# EAGLE design Varmo - Rev A3 (EAGLE 7.7.0)

## Sheet 1 of 3
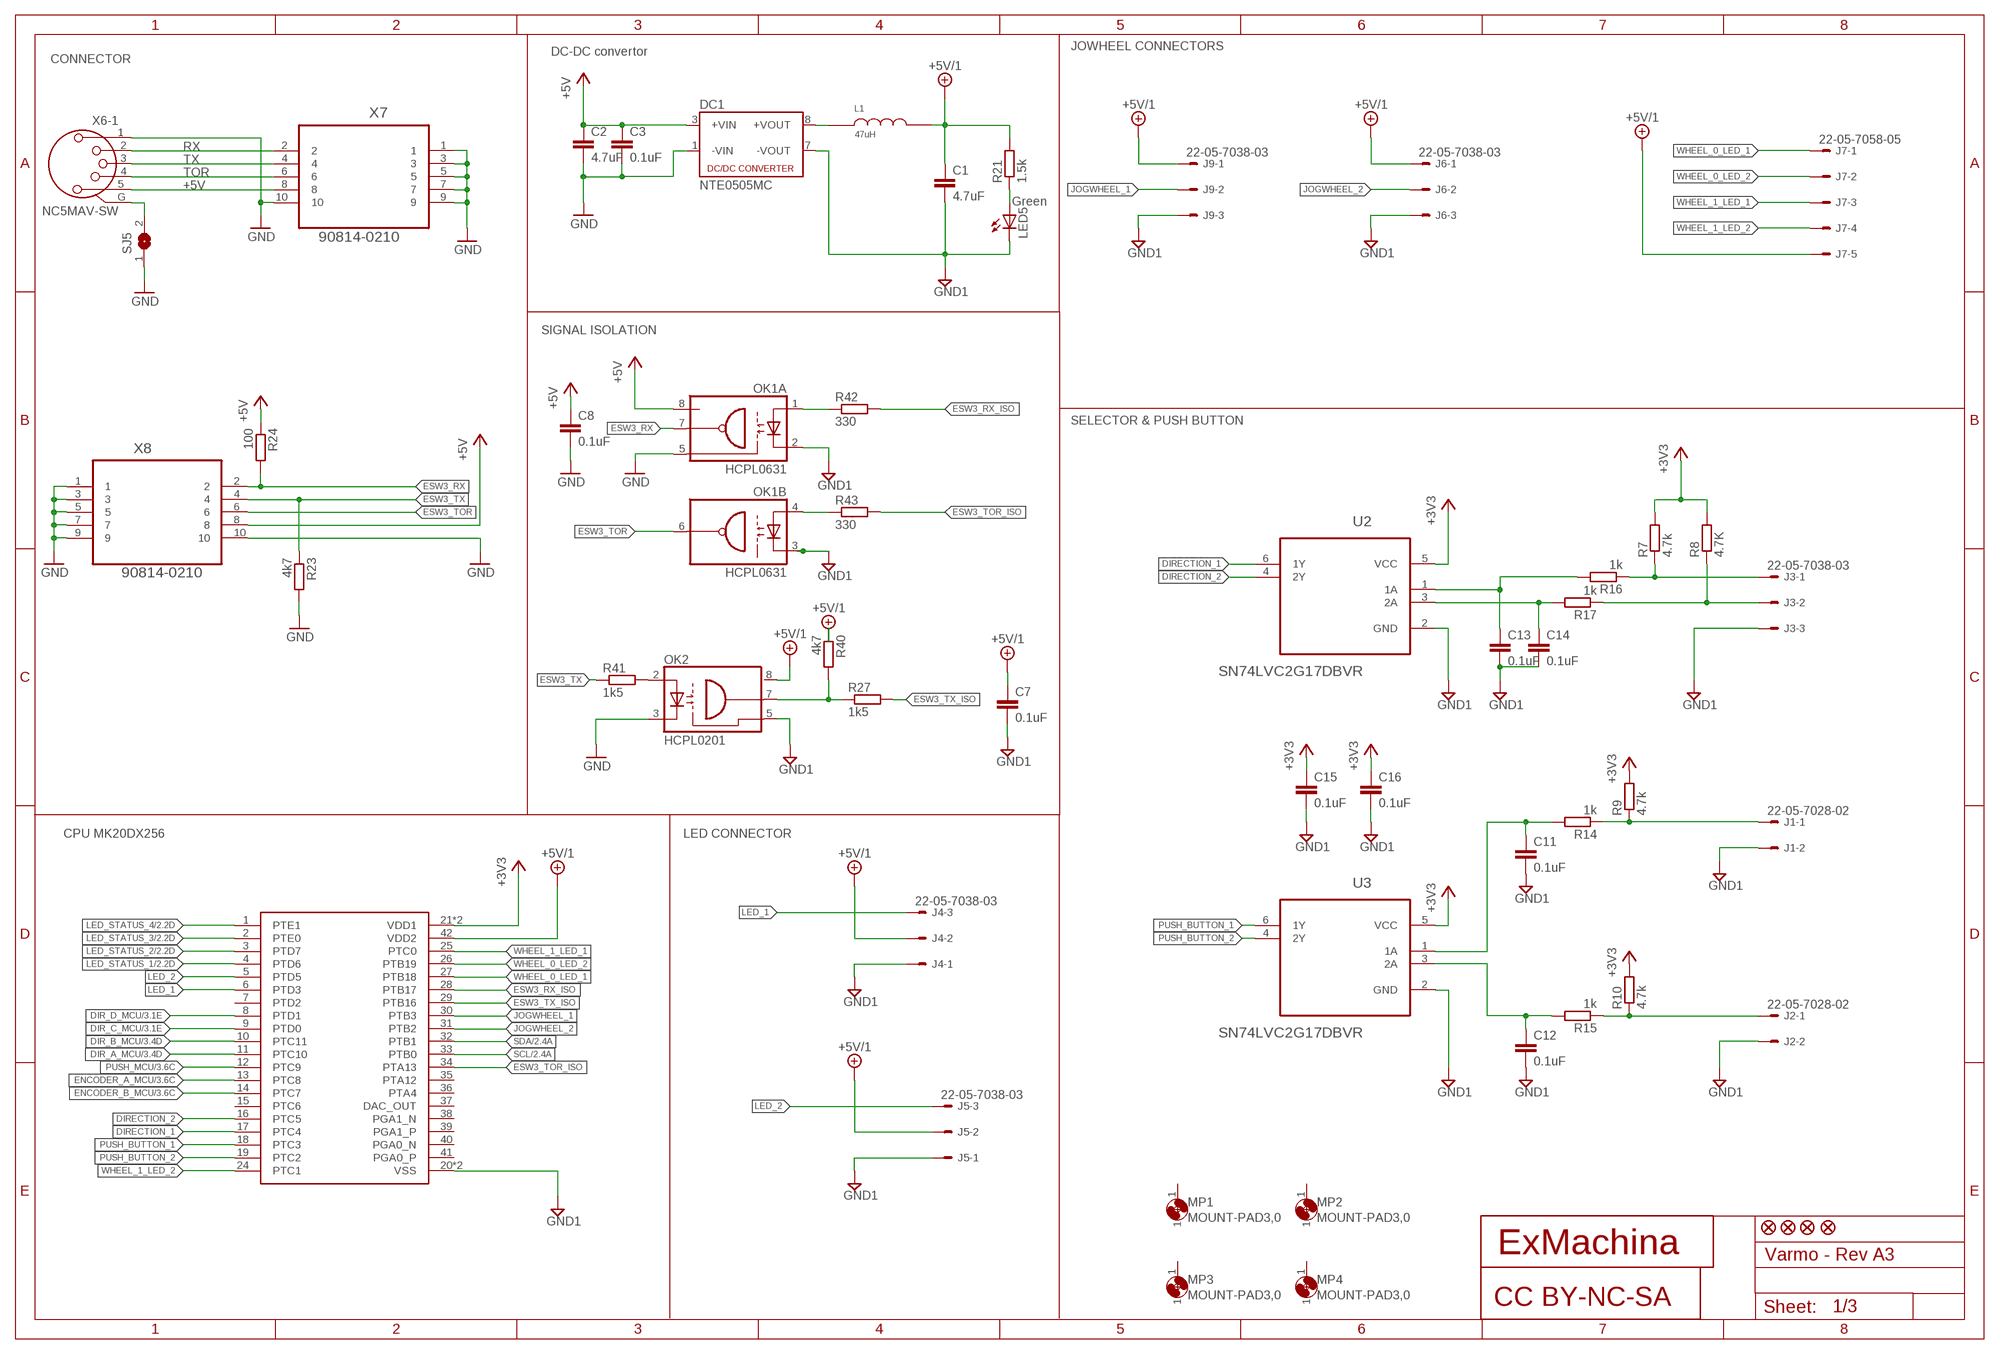
[diagram p0: schematic, sheet 1]

### Parts
C1  4.7uF  C-EUC0603  [C0603]
C2  4.7uF  C-EUC0603  [C0603]
C3  0.1uF  C-EUC0603  [C0603]
C7  0.1uF  C-EUC0603  [C0603]
C8  0.1uF  C-EUC0603  [C0603]
C11  0.1uF  C-EUC0603  [C0603]
C12  0.1uF  C-EUC0603  [C0603]
C13  0.1uF  C-EUC0603  [C0603]
C14  0.1uF  C-EUC0603  [C0603]
C15  0.1uF  C-EUC0603  [C0603]
C16  0.1uF  C-EUC0603  [C0603]
DC1  NTE0505MC  [NTE]
J1  22-05-7028-02  [7395-02]
J2  22-05-7028-02  [7395-02]
J3  22-05-7038-03  [7395-03]
J4  22-05-7038-03  [7395-03]
J5  22-05-7038-03  [7395-03]
J6  22-05-7038-03  [7395-03]
J7  22-05-7058-05  [7395-05]
J9  22-05-7038-03  [7395-03]
JP1  FIDUCIAL1X2  [FIDUCIAL-1X2]
JP2  FIDUCIAL1X2  [FIDUCIAL-1X2]
JP3  FIDUCIAL1X2  [FIDUCIAL-1X2]
JP4  FIDUCIAL1X2  [FIDUCIAL-1X2]
L1  47uH  82473C  [8200]
LED5  Green  LEDCHIP-LED0603  [CHIP-LED0603]
MP1  MOUNT-PAD3,0  [P3,0]
MP2  MOUNT-PAD3,0  [P3,0]
MP3  MOUNT-PAD3,0  [P3,0]
MP4  MOUNT-PAD3,0  [P3,0]
OK1  HCPL0631  [SOIC08]
OK2  HCPL0201  [SOIC08]
R7  4.7k  R-EU_R0603  [R0603]
R8  4.7K  R-EU_R0603  [R0603]
R9  4.7k  R-EU_R0603  [R0603]
R10  4.7k  R-EU_R0603  [R0603]
R14  1k  R-EU_R0603  [R0603]
R15  1k  R-EU_R0603  [R0603]
R16  1k  R-EU_R0603  [R0603]
R17  1k  R-EU_R0603  [R0603]
R21  1.5k  R-EU_R0603  [R0603]
R23  4k7  R-EU_R0603  [R0603]
R24  100  R-EU_R0603  [R0603]
R27  1k5  R-EU_R0603  [R0603]
R40  4k7  R-EU_R0603  [R0603]
R41  1k5  R-EU_R0603  [R0603]
R42  330  R-EU_R0603  [R0603]
R43  330  R-EU_R0603  [R0603]
SJ5  SJ  [SJ]
U2  SN74LVC2G17DBVR  [SOT95P280X145-6N]
U3  SN74LVC2G17DBVR  [SOT95P280X145-6N]
U8  M20DX256  [MK_CUSTOM]
U$1  CC-BY-NC-SA  [CC-BY-NC-SA]
U$6  EXMACHINA-LOGO-NAME  [EXM-LOGO-BASELINE]
X6  NC5MAV-SW  [NC5MAV-SW]
X7  90814-0210  [MOLEX_90814-0210]
X8  90814-0210  [MOLEX_90814-0210]

### Nets
+3V3: C15.1 C16.1 R7.2 R8.2 R9.2 R10.2 U2.5(VCC) U3.5(VCC) U8.21(VDD1) U8.22(VDD1) ; also sheet 2,3
+5V: C2.1 C3.1 C8.1 DC1.3(+VIN) OK1.8(A:VCC) R24.1 X6.5 X7.8 X8.8
+5V/1: C1.1 C7.1 J4.2 J5.2 J6.1 J7.5 J9.1 L1.2 OK2.8(VCC) R21.2 R40.1 U8.42(VDD2) ; also sheet 2,3
DIR_A_MCU: U8.11(PTC10) ; also sheet 3
DIR_B_MCU: U8.10(PTC11) ; also sheet 3
DIR_C_MCU: U8.9(PTD0) ; also sheet 3
DIR_D_MCU: U8.8(PTD1) ; also sheet 3
DIRECTION_1: U2.6(1Y) U8.17(PTC4)
DIRECTION_2: U2.4(2Y) U8.16(PTC5)
ENCODER_A_MCU: U8.13(PTC8) ; also sheet 3
ENCODER_B_MCU: U8.14(PTC7) ; also sheet 3
ESW3_RX: OK1.7(A:VO) R24.2 X8.2
ESW3_RX_ISO: R42.2 U8.28(PTB17)
ESW3_TOR: OK1.6(B:VO2) X8.6
ESW3_TOR_ISO: R43.2 U8.34(PTA13)
ESW3_TX: R23.1 R41.1 X8.4
ESW3_TX_ISO: R27.2 U8.29(PTB16)
GND: C2.2 C3.2 C8.2 DC1.1(-VIN) OK1.5(A:GND) OK2.3(C) R23.2 SJ5.1 X6.1 X7.1 X7.3 X7.5 X7.7 X7.9 X7.10 X8.1 X8.3 X8.5 X8.7 X8.9 X8.10
GND1: C1.2 C7.2 C11.2 C12.2 C13.2 C14.2 C15.2 C16.2 DC1.7(-VOUT) J1.2 J2.2 J3.3 J4.1 J5.1 J6.3 J9.3 LED5.C OK1.2(A:C1) OK1.3(B:C2) OK2.5(GND) U2.2(GND) U3.2(GND) U8.20(VSS) U8.23(VSS) ; also sheet 2,3
JOGWHEEL_1: J9.2 U8.30(PTB3)
JOGWHEEL_2: J6.2 U8.31(PTB2)
LED_1: J4.3 U8.6(PTD3)
LED_2: J5.3 U8.5(PTD5)
LED_STATUS_1: U8.4(PTD6) ; also sheet 2
LED_STATUS_2: U8.3(PTD7) ; also sheet 2
LED_STATUS_3: U8.2(PTE0) ; also sheet 2
LED_STATUS_4: U8.1(PTE1) ; also sheet 2
N$1: DC1.8(+VOUT) L1.1
N$6: J2.1 R10.1 R15.1
N$7: J1.1 R9.1 R14.1
N$8: J3.1 R7.1 R16.1
N$9: J3.2 R8.1 R17.1
N$10: C13.1 R16.2 U2.1(1A)
N$11: C14.1 R17.2 U2.3(2A)
N$12: C12.1 R15.2 U3.3(2A)
N$13: C11.1 R14.2 U3.1(1A)
N$15: OK2.7(VO) R27.1 R40.2
N$23: SJ5.2 X6.G(-1:G)
N$35: LED5.A R21.1
N$37: OK1.1(A:A1) R42.1
N$38: OK1.4(B:A2) R43.1
N$39: OK2.2(A) R41.2
PUSH_BUTTON_1: U3.6(1Y) U8.18(PTC3)
PUSH_BUTTON_2: U3.4(2Y) U8.19(PTC2)
PUSH_MCU: U8.12(PTC9) ; also sheet 3
RX: X6.2 X7.2
SCL: U8.33(PTB0) ; also sheet 2
SDA: U8.32(PTB1) ; also sheet 2
TOR: X6.4 X7.6
TX: X6.3 X7.4
WHEEL_0_LED_1: J7.1 U8.27(PTB18)
WHEEL_0_LED_2: J7.2 U8.26(PTB19)
WHEEL_1_LED_1: J7.3 U8.25(PTC0)
WHEEL_1_LED_2: J7.4 U8.24(PTC1)
Unconnected: MP1.1 MP2.1 MP3.1 MP4.1 U8.7(PTD2) U8.15(PTC6) U8.35(PTA12) U8.36(PTA4) U8.37(DAC_OUT) U8.38(PGA1_N) U8.39(PGA1_P) U8.40(PGA0_N) U8.41(PGA0_P) X6.N(-2:N) X6.NC(-2:NC) X6.NO(-2:NO)

### Notes on the sheet
- JOWHEEL CONNECTORS
- DC-DC convertor
- CONNECTOR
- SIGNAL ISOLATION
- SELECTOR & PUSH BUTTON
- CPU MK20DX256 | LED CONNECTOR

## Sheet 2 of 3: LCD Screen and LED panel
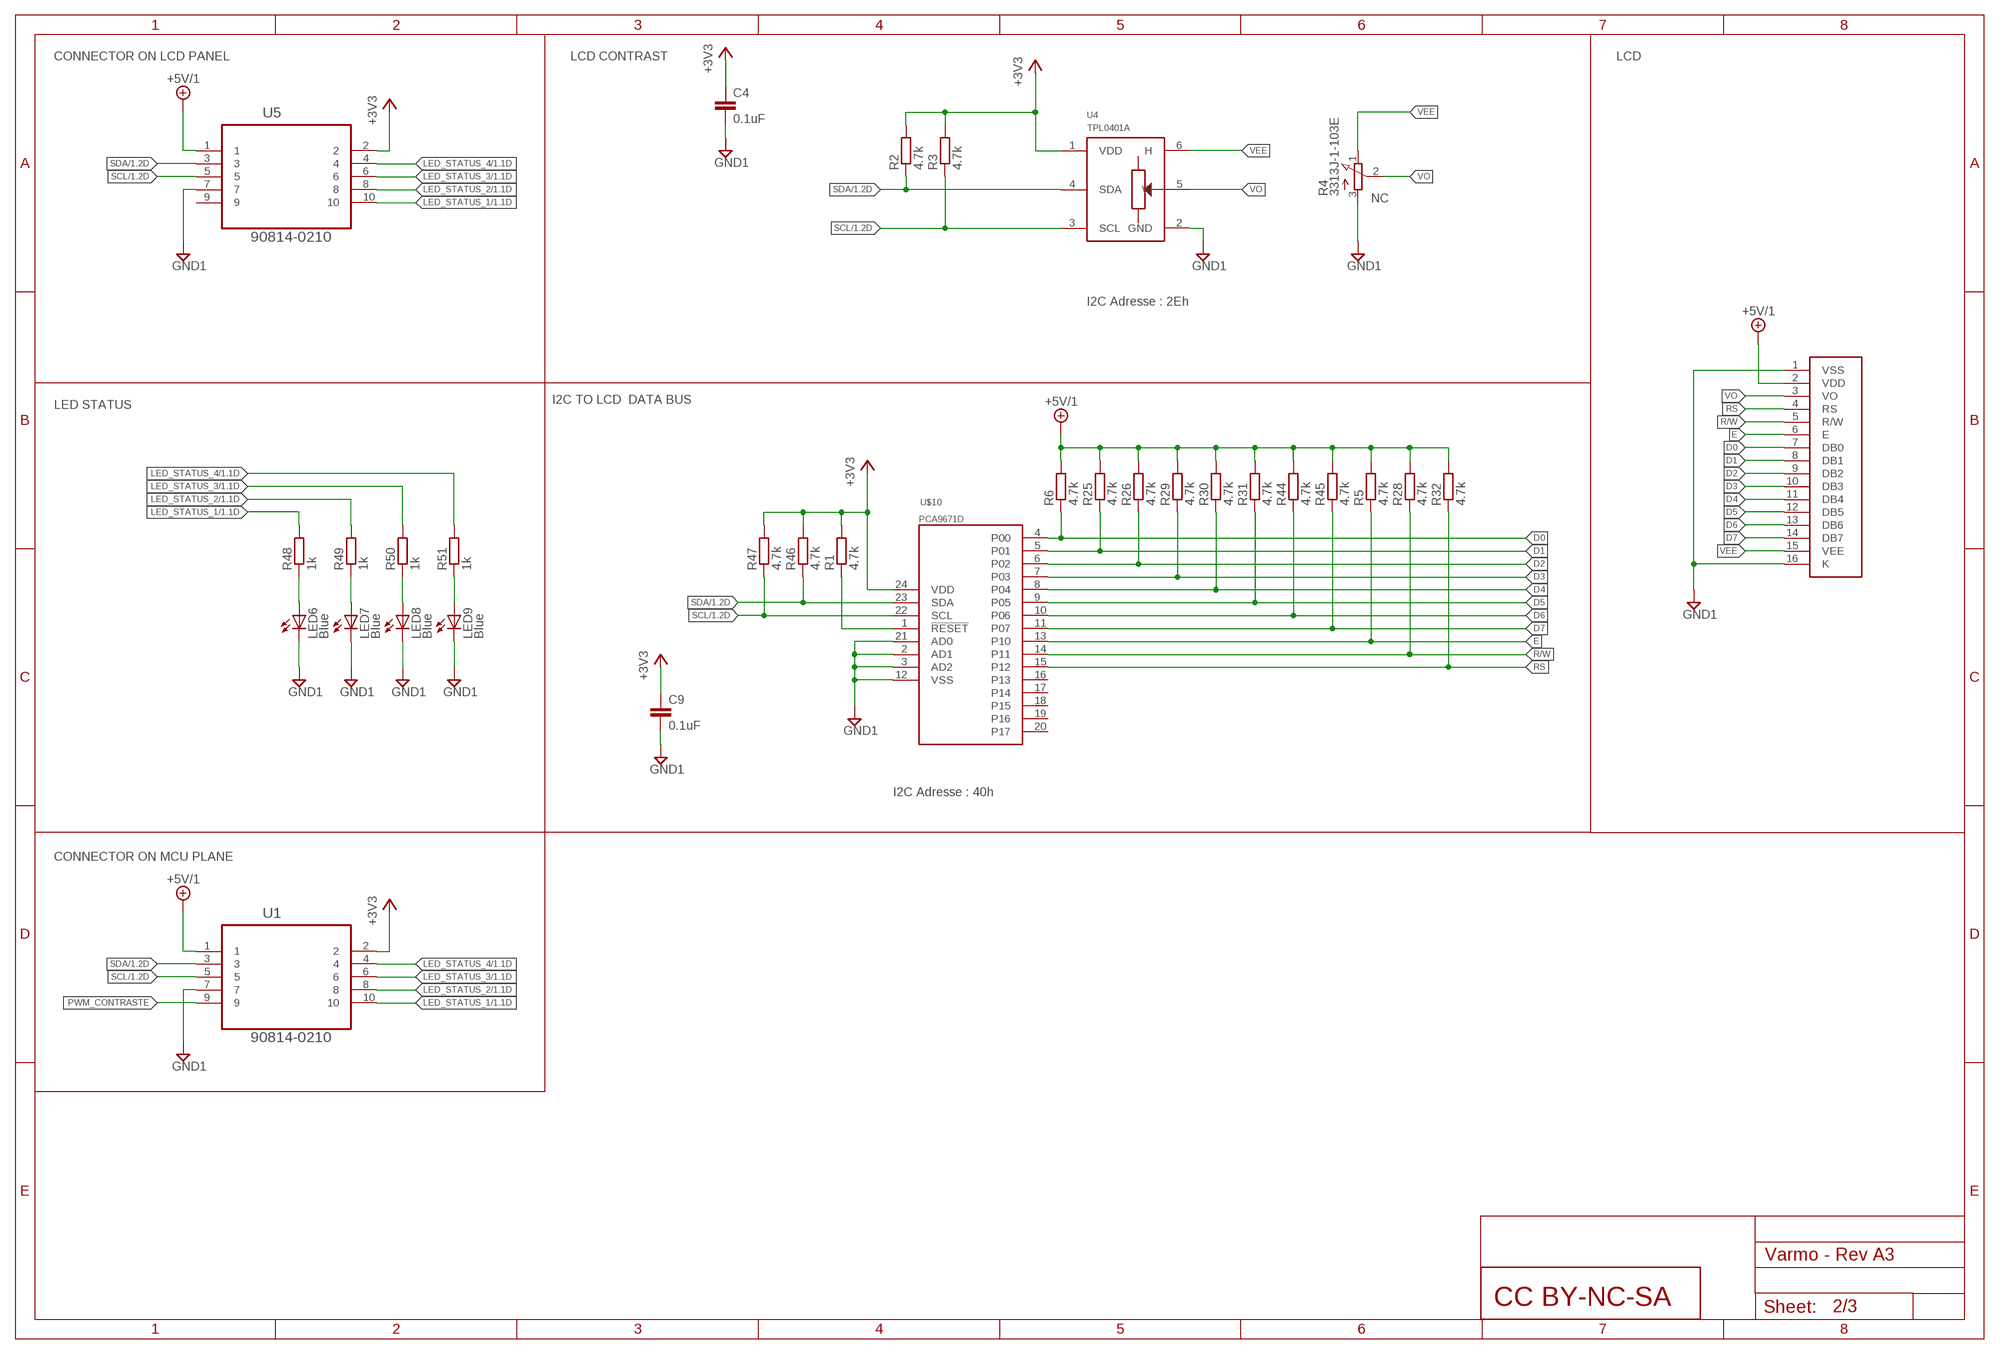
[diagram p1: schematic, sheet 2]

### Parts
C4  0.1uF  C-EUC0603  [C0603]
C9  0.1uF  C-EUC0603  [C0603]
LCD1  MC41605A12W  [CONNECTOR]
LED6  Blue  LEDCHIP-LED0603  [CHIP-LED0603]
LED7  Blue  LEDCHIP-LED0603  [CHIP-LED0603]
LED8  Blue  LEDCHIP-LED0603  [CHIP-LED0603]
LED9  Blue  LEDCHIP-LED0603  [CHIP-LED0603]
R1  4.7k  R-EU_R0603  [R0603]
R2  4.7k  R-EU_R0603  [R0603]
R3  4.7k  R-EU_R0603  [R0603]
R4  3313J-1-103E  [3313J]
R5  4.7k  R-EU_R0603  [R0603]
R6  4.7k  R-EU_R0603  [R0603]
R25  4.7k  R-EU_R0603  [R0603]
R26  4.7k  R-EU_R0603  [R0603]
R28  4.7k  R-EU_R0603  [R0603]
R29  4.7k  R-EU_R0603  [R0603]
R30  4.7k  R-EU_R0603  [R0603]
R31  4.7k  R-EU_R0603  [R0603]
R32  4.7k  R-EU_R0603  [R0603]
R44  4.7k  R-EU_R0603  [R0603]
R45  4.7k  R-EU_R0603  [R0603]
R46  4.7k  R-EU_R0603  [R0603]
R47  4.7k  R-EU_R0603  [R0603]
R48  1k  R-EU_R0603  [R0603]
R49  1k  R-EU_R0603  [R0603]
R50  1k  R-EU_R0603  [R0603]
R51  1k  R-EU_R0603  [R0603]
U1  90814-0210  [MOLEX_90814-0210]
U4  TPL0401A  [SC-70-DCK]
U5  90814-0210  [MOLEX_90814-0210]
U$5  CC-BY-NC-SA  [CC-BY-NC-SA]
U$10  PCA9671D  [SOT137-1]

### Nets
+3V3: C4.1 C9.1 R1.2 R2.2 R3.2 R46.2 R47.2 U1.2 U4.1(VDD) U5.2 U$10.24(VDD) ; also sheet 1,3
+5V/1: LCD1.2(VDD) R5.2 R6.2 R25.2 R26.2 R28.2 R29.2 R30.2 R31.2 R32.2 R44.2 R45.2 U1.1 U5.1 ; also sheet 1,3
D0: LCD1.7(DB0) R6.1 U$10.4(P00)
D1: LCD1.8(DB1) R25.1 U$10.5(P01)
D2: LCD1.9(DB2) R26.1 U$10.6(P02)
D3: LCD1.10(DB3) R29.1 U$10.7(P03)
D4: LCD1.11(DB4) R30.1 U$10.8(P04)
D5: LCD1.12(DB5) R31.1 U$10.9(P05)
D6: LCD1.13(DB6) R44.1 U$10.10(P06)
D7: LCD1.14(DB7) R45.1 U$10.11(P07)
E: LCD1.6(E) R5.1 U$10.13(P10)
GND1: C4.2 C9.2 LCD1.1(VSS) LCD1.16(K) LED6.C LED7.C LED8.C LED9.C R4.3(A) U1.7 U4.2(GND) U5.7 U$10.2(AD1) U$10.3(AD2) U$10.12(VSS) U$10.21(AD0) ; also sheet 1,3
LED_STATUS_1: R48.2 U1.10 U5.10 ; also sheet 1
LED_STATUS_2: R49.2 U1.8 U5.8 ; also sheet 1
LED_STATUS_3: R50.2 U1.6 U5.6 ; also sheet 1
LED_STATUS_4: R51.2 U1.4 U5.4 ; also sheet 1
N$2: R1.1 U$10.1(!RESET)
N$4: LED6.A R48.1
N$22: LED7.A R49.1
N$24: LED8.A R50.1
N$29: LED9.A R51.1
PWM_CONTRASTE: U1.9
R/W: LCD1.5(R/W) R28.1 U$10.14(P11)
RS: LCD1.4(RS) R32.1 U$10.15(P12)
SCL: R3.1 R47.1 U1.5 U4.3(SCL) U5.5 U$10.22(SCL) ; also sheet 1
SDA: R2.1 R46.1 U1.3 U4.4(SDA) U5.3 U$10.23(SDA) ; also sheet 1
VEE: LCD1.15(VEE) R4.1(E) U4.6(H)
VO: LCD1.3(VO) R4.2(S) U4.5(W)
Unconnected: U5.9 U$10.16(P13) U$10.17(P14) U$10.18(P15) U$10.19(P16) U$10.20(P17)

### Notes on the sheet
- CONNECTOR ON LCD PANEL | LCD CONTRAST | LCD
- NC
- I2C Adresse : 2Eh
- I2C TO LCD  DATA BUS
- LED STATUS
- I2C Adresse : 40h
- CONNECTOR ON MCU PLANE

## Sheet 3 of 3: ENCODER AND JOYSTICK
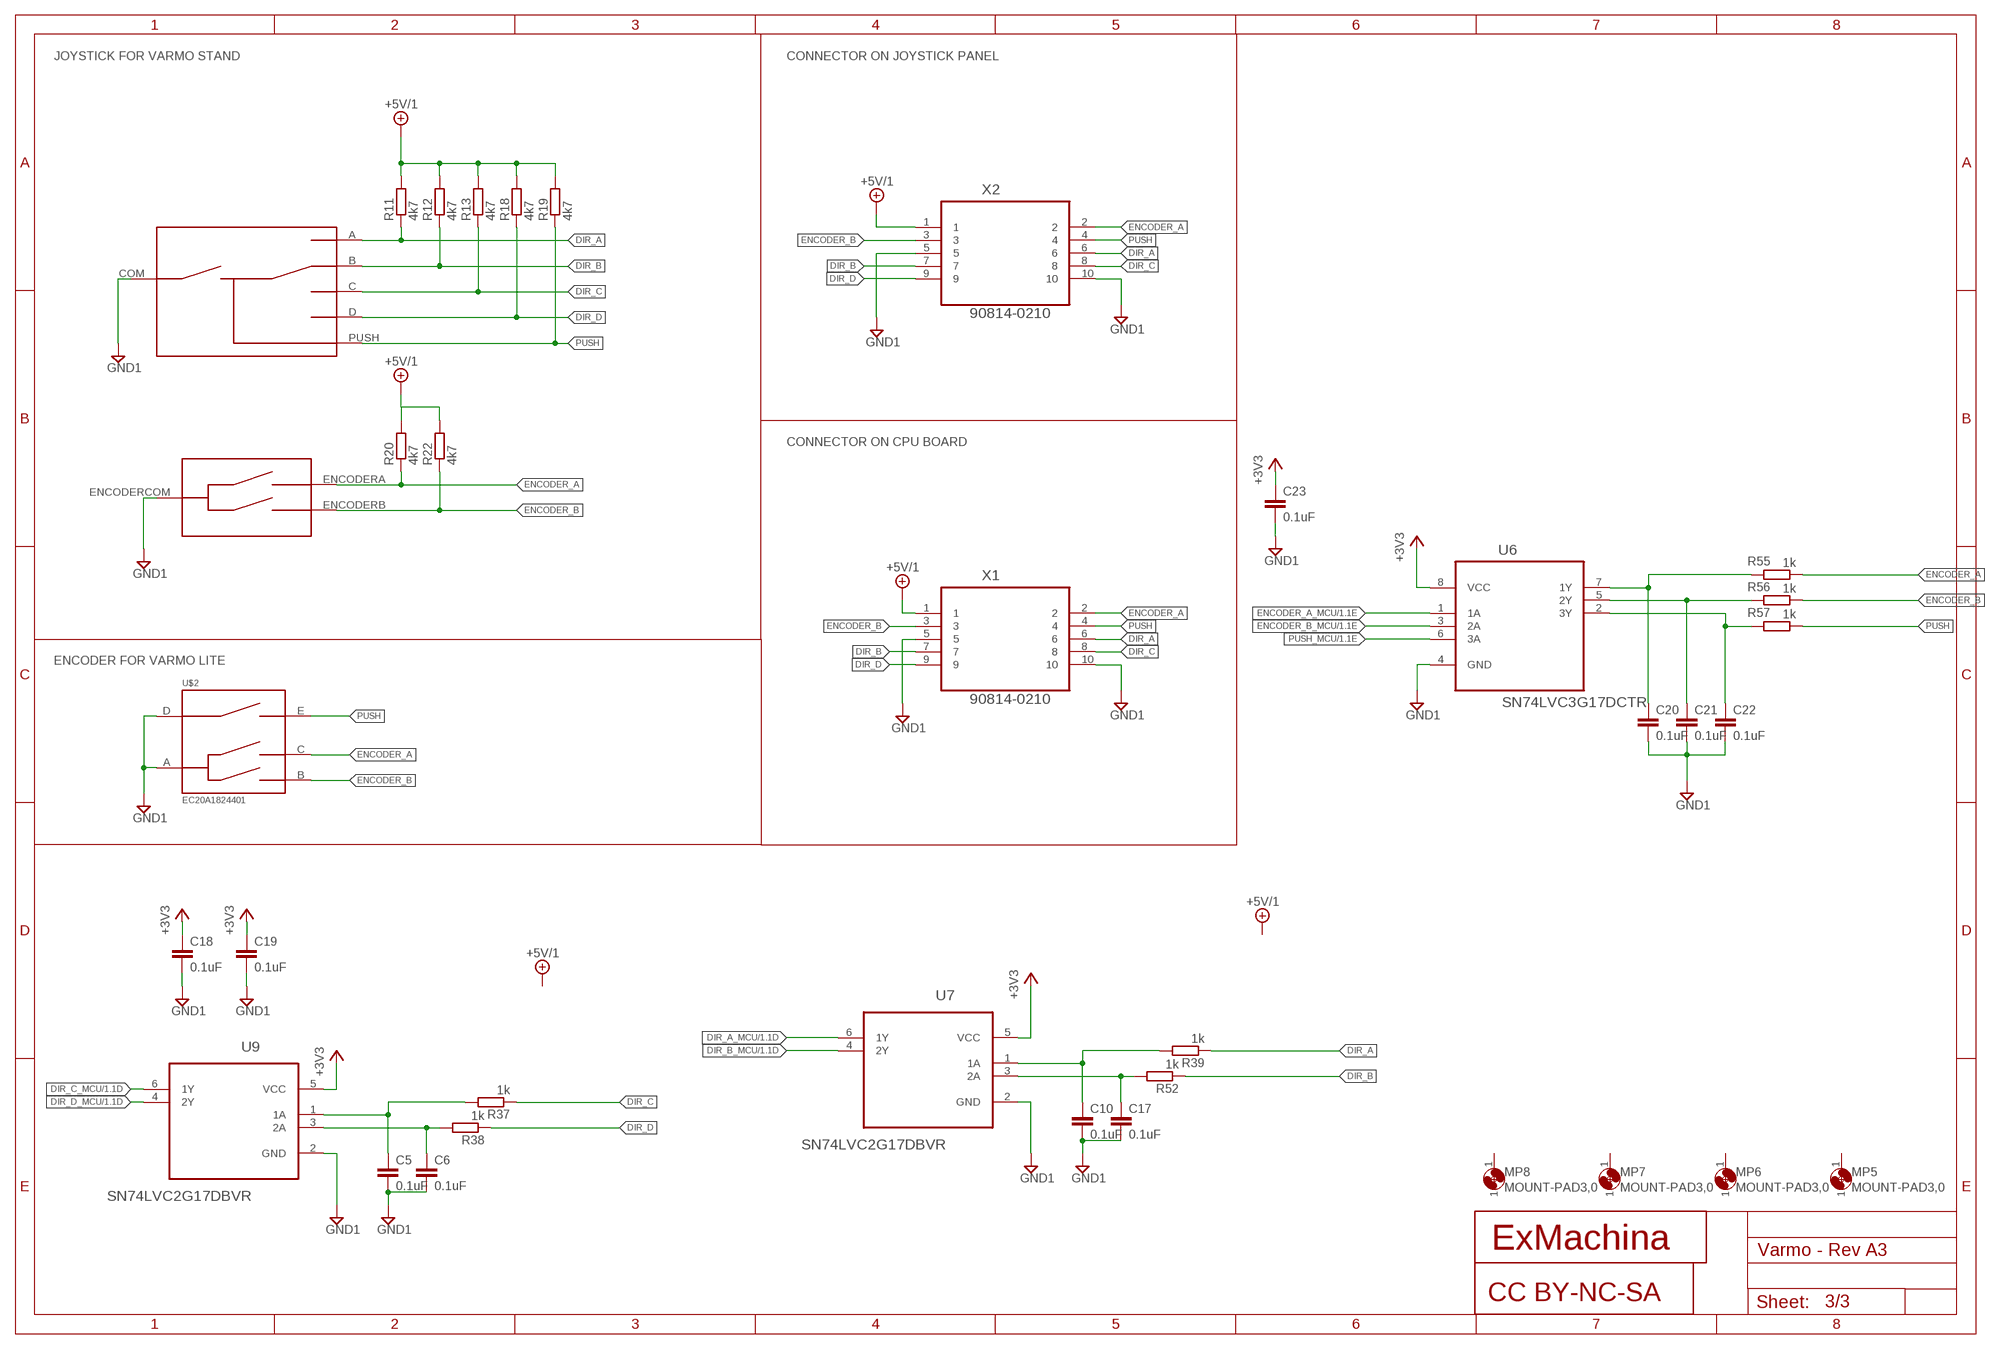
[diagram p2: schematic, sheet 3]

### Parts
C5  0.1uF  C-EUC0603  [C0603]
C6  0.1uF  C-EUC0603  [C0603]
C10  0.1uF  C-EUC0603  [C0603]
C17  0.1uF  C-EUC0603  [C0603]
C18  0.1uF  C-EUC0603  [C0603]
C19  0.1uF  C-EUC0603  [C0603]
C20  0.1uF  C-EUC0603  [C0603]
C21  0.1uF  C-EUC0603  [C0603]
C22  0.1uF  C-EUC0603  [C0603]
C23  0.1uF  C-EUC0603  [C0603]
ENC1  RKJXTF42001  [RKJXT1F]
MP5  MOUNT-PAD3,0  [P3,0]
MP6  MOUNT-PAD3,0  [P3,0]
MP7  MOUNT-PAD3,0  [P3,0]
MP8  MOUNT-PAD3,0  [P3,0]
R11  4k7  R-EU_R0603  [R0603]
R12  4k7  R-EU_R0603  [R0603]
R13  4k7  R-EU_R0603  [R0603]
R18  4k7  R-EU_R0603  [R0603]
R19  4k7  R-EU_R0603  [R0603]
R20  4k7  R-EU_R0603  [R0603]
R22  4k7  R-EU_R0603  [R0603]
R37  1k  R-EU_R0603  [R0603]
R38  1k  R-EU_R0603  [R0603]
R39  1k  R-EU_R0603  [R0603]
R52  1k  R-EU_R0603  [R0603]
R55  1k  R-EU_R0603  [R0603]
R56  1k  R-EU_R0603  [R0603]
R57  1k  R-EU_R0603  [R0603]
U6  SN74LVC3G17DCTR  [SOP65P400X130-8N]
U7  SN74LVC2G17DBVR  [SOT95P280X145-6N]
U9  SN74LVC2G17DBVR  [SOT95P280X145-6N]
U$2  EC20A1824401  [EC20A]
U$3  EXMACHINA-LOGO-NAME  [EXM-LOGO-BASELINE]
U$4  CC-BY-NC-SA  [CC-BY-NC-SA]
X1  90814-0210  [MOLEX_90814-0210]
X2  90814-0210  [MOLEX_90814-0210]

### Nets
+3V3: C18.1 C19.1 C23.1 U6.8(VCC) U7.5(VCC) U9.5(VCC) ; also sheet 1,2
+5V/1: R11.2 R12.2 R13.2 R18.2 R19.2 R20.2 R22.2 X1.1 X2.1 ; also sheet 1,2
DIR_A: ENC1.A R11.1 R39.1 X1.6 X2.6
DIR_A_MCU: U7.6(1Y) ; also sheet 1
DIR_B: ENC1.B R12.1 R52.1 X1.7 X2.7
DIR_B_MCU: U7.4(2Y) ; also sheet 1
DIR_C: ENC1.C R13.1 R37.1 X1.8 X2.8
DIR_C_MCU: U9.6(1Y) ; also sheet 1
DIR_D: ENC1.D R18.1 R38.1 X1.9 X2.9
DIR_D_MCU: U9.4(2Y) ; also sheet 1
ENCODER_A: ENC1.ENCODERA(A) R20.1 R55.1 U$2.C(ENCODER_A) X1.2 X2.2
ENCODER_A_MCU: U6.1(1A) ; also sheet 1
ENCODER_B: ENC1.ENCODERB(B) R22.1 R56.1 U$2.B(ENCODER_B) X1.3 X2.3
ENCODER_B_MCU: U6.3(2A) ; also sheet 1
GND1: C5.2 C6.2 C10.2 C17.2 C18.2 C19.2 C20.2 C21.2 C22.2 C23.2 ENC1.COM ENC1.ENCODERCOM(COM) U6.4(GND) U7.2(GND) U9.2(GND) U$2.A(COM) U$2.D(COM_PUSH) X1.5 X1.10 X2.5 X2.10 ; also sheet 1,2
N$17: C10.1 R39.2 U7.1(1A)
N$30: C17.1 R52.2 U7.3(2A)
N$31: C5.1 R37.2 U9.1(1A)
N$32: C6.1 R38.2 U9.3(2A)
N$40: C20.1 R55.2 U6.7(1Y)
N$41: C21.1 R56.2 U6.5(2Y)
N$42: C22.1 R57.2 U6.2(3Y)
PUSH: ENC1.PUSH R19.1 R57.1 U$2.E(PUSH) X1.4 X2.4
PUSH_MCU: U6.6(3A) ; also sheet 1
Unconnected: MP5.1 MP6.1 MP7.1 MP8.1

### Notes on the sheet
- JOYSTICK FOR VARMO STAND | CONNECTOR ON JOYSTICK PANEL
- CONNECTOR ON CPU BOARD
- ENCODER FOR VARMO LITE

## Library data of the parts
C1 C2 = rcl:C-EU: CAPACITOR, European symbol; MPN: MC0603X475K100CT; OC_NEWARK: 06X6198
C3 C5-C8 C10-C23 = rcl:C-EU: CAPACITOR, European symbol; MPN: MC0603B104K160CT; OC_NEWARK: 06R4923
C4 C9 = rcl:C-EU: CAPACITOR, European symbol
DC1 = dc-dc-converter:NTE; MF: C & D TECHNOLOGIES, INC; MPN: NTE0505MC; OC_NEWARK: 61K3399
ENC1 = encoder:RKJXTF: 4-directional Stick Switch (with Encoder + Center-push Function)
J1 J2 = con-molex:22-?-02: CONNECTOR wire to board 2.54 mm (.1 inch) pitch header; OC_FARNELL: 9731601; OC_NEWARK: unknown
J3-J6 J9 = con-molex:22-?-03: CONNECTOR wire to board 2.54 mm (.1 inch) pitch header; OC_FARNELL: unknown; OC_NEWARK: unknown
J7 = con-molex:22-?-05: CONNECTOR wire to board 2.54 mm (.1 inch) pitch header; OC_FARNELL: unknown; OC_NEWARK: unknown
JP1-JP4 = SparkFun:FIDUCIAL: Fiducial Alignment Points Various fiducial points for machine vision alignment.
L1 = murata-inductance:82473C; MPN: 82473C; OC_NEWARK: 40M7122
LCD1 = midas:MC41605A12W
LED5 = led:LED: LED OSRAM: - CHIPLED LG R971, LG N971, LY N971, LG Q971, LY Q971, LO R971, LY R971 LH N974, LH R974 LS Q976, LO Q976, LY Q976 LO Q996 - Hyper CHIPLED LW Q18S LB Q993, LB Q99A, LB R99A - SideLED LS A670, LO A670, LY A670, LG A670, LP A670 LB A673, LV A673, LT A673, LW A673 LH A674 LY A675 LS A676, LA A676, LO A676, LY A676, LW A676 LS A679, LY A679, LG A679 - Hyper Micro SIDELED® LS Y876, LA Y876, LO Y876, LY Y876 LT Y87S - SmartLED LW L88C, LW L88S LB L89C, LB L89S, LG L890 LS L89K, LO L89K, LY L89K LS L896, LA L896, LO L896, LY L896 - TOPLED LS T670, LO T670, LY T670, LG T670, LP T670 LSG T670, LSP T670, LSY T670, LOP T670, LYG T670 LG T671, LOG T671, LSG T671 LB T673, LV T673, LT T673, LW T673 LH T674 LS T676, LA T676, LO T676, LY T676, LB T676, LH T676, LSB T676, LW T676 LB T67C, LV T67C, LT T67C, LS T67K, LO T67K, LY T67K, LW E67C LS E67B, LA E67B, LO E67B, LY E67B, LB E67C, LV E67C, LT E67C LW T67C LS T679, LY T679, LG T679 LS T770, LO T770, LY T770, LG T770, LP T770 LB T773, LV T773, LT T773, LW T773 LH T774 LS E675, LA E675, LY E675, LS T675 LS T776, LA T776, LO T776, LY T776, LB T776 LHGB T686 LT T68C, LB T68C - Hyper Mini TOPLED® LB M676 - Mini TOPLED Santana® LG M470 LS M47K, LO M47K, LY M47K Source: http://www.osram.convergy.de LUXEON: - LUMILED® LXK2-PW12-R00, LXK2-PW12-S00, LXK2-PW14-U00, LXK2-PW14-V00 LXK2-PM12-R00, LXK2-PM12-S00, LXK2-PM14-U00 LXK2-PE12-Q00, LXK2-PE12-R00, LXK2-PE12-S00, LXK2-PE14-T00, LXK2-PE14-U00 LXK2-PB12-K00, LXK2-PB12-L00, LXK2-PB12-M00, LXK2-PB14-N00, LXK2-PB14-P00, LXK2-PB14-Q00 LXK2-PR12-L00, LXK2-PR12-M00, LXK2-PR14-Q00, LXK2-PR14-R00 LXK2-PD12-Q00, LXK2-PD12-R00, LXK2-PD12-S00 LXK2-PH12-R00, LXK2-PH12-S00 LXK2-PL12-P00, LXK2-PL12-Q00, LXK2-PL12-R00 Source: www.luxeon.com KINGBRIGHT: KA-3528ASYC Source: www.kingbright.com; MPN: OVS-0604; OC_NEWARK: 15R2206
LED6-LED9 = led:LED: LED OSRAM: - CHIPLED LG R971, LG N971, LY N971, LG Q971, LY Q971, LO R971, LY R971 LH N974, LH R974 LS Q976, LO Q976, LY Q976 LO Q996 - Hyper CHIPLED LW Q18S LB Q993, LB Q99A, LB R99A - SideLED LS A670, LO A670, LY A670, LG A670, LP A670 LB A673, LV A673, LT A673, LW A673 LH A674 LY A675 LS A676, LA A676, LO A676, LY A676, LW A676 LS A679, LY A679, LG A679 - Hyper Micro SIDELED® LS Y876, LA Y876, LO Y876, LY Y876 LT Y87S - SmartLED LW L88C, LW L88S LB L89C, LB L89S, LG L890 LS L89K, LO L89K, LY L89K LS L896, LA L896, LO L896, LY L896 - TOPLED LS T670, LO T670, LY T670, LG T670, LP T670 LSG T670, LSP T670, LSY T670, LOP T670, LYG T670 LG T671, LOG T671, LSG T671 LB T673, LV T673, LT T673, LW T673 LH T674 LS T676, LA T676, LO T676, LY T676, LB T676, LH T676, LSB T676, LW T676 LB T67C, LV T67C, LT T67C, LS T67K, LO T67K, LY T67K, LW E67C LS E67B, LA E67B, LO E67B, LY E67B, LB E67C, LV E67C, LT E67C LW T67C LS T679, LY T679, LG T679 LS T770, LO T770, LY T770, LG T770, LP T770 LB T773, LV T773, LT T773, LW T773 LH T774 LS E675, LA E675, LY E675, LS T675 LS T776, LA T776, LO T776, LY T776, LB T776 LHGB T686 LT T68C, LB T68C - Hyper Mini TOPLED® LB M676 - Mini TOPLED Santana® LG M470 LS M47K, LO M47K, LY M47K Source: http://www.osram.convergy.de LUXEON: - LUMILED® LXK2-PW12-R00, LXK2-PW12-S00, LXK2-PW14-U00, LXK2-PW14-V00 LXK2-PM12-R00, LXK2-PM12-S00, LXK2-PM14-U00 LXK2-PE12-Q00, LXK2-PE12-R00, LXK2-PE12-S00, LXK2-PE14-T00, LXK2-PE14-U00 LXK2-PB12-K00, LXK2-PB12-L00, LXK2-PB12-M00, LXK2-PB14-N00, LXK2-PB14-P00, LXK2-PB14-Q00 LXK2-PR12-L00, LXK2-PR12-M00, LXK2-PR14-Q00, LXK2-PR14-R00 LXK2-PD12-Q00, LXK2-PD12-R00, LXK2-PD12-S00 LXK2-PH12-R00, LXK2-PH12-S00 LXK2-PL12-P00, LXK2-PL12-Q00, LXK2-PL12-R00 Source: www.luxeon.com KINGBRIGHT: KA-3528ASYC Source: www.kingbright.com
MP1-MP8 = holes:MOUNT-PAD: MOUNTING HOLE with drill center marker
OK1 = optocoupler:HCPL0631
OK2 = optocoupler:HCPL0201
R1-R3 R5 R6 R25 R26 R28-R32 R44-R51 = rcl:R-EU_: RESISTOR, European symbol
R4 = pot:3313J
R7-R10 R14-R17 R37-R39 R52 R55-R57 = rcl:R-EU_: RESISTOR, European symbol; MPN: MCMR06X4701FTL; OC_NEWARK: 86T3649
R11-R13 R18-R20 R22-R24 R27 R40-R43 = rcl:R-EU_: RESISTOR, European symbol; MPN: MCMR06X000 PTL; OC_NEWARK: 86T3500
R21 = rcl:R-EU_: RESISTOR, European symbol; MPN: MCMR06X1501FTL; OC_NEWARK: 86T3542
SJ5 = jumper:SJ: SMD solder JUMPER; OC_NEWARK: unknown
U1 U5 X1 X2 X7 X8 = Molex_By_element14_Batch_1:90814-0210: CONN HEADER 10POS 1.27MM SMD TIN; MPN: 90814-0210; OC_FARNELL: 1757026; OC_NEWARK: 34R6217; PACKAGE: CONN-10POS; SUPPLIER: Molex
U2 U3 U7 U9 = ti:SN74LVC2G17DBVR: DUAL SCHMITT-TRIGGER BUFFER; MF: TEXAS INSTRUMENTS; MPN: SN74LVC2G17DBVR; OC_FARNELL: 1470776; OC_NEWARK: 76C4207; PACKAGE: SOT-23-6; SUPPLIER: Texas Instruments
U4 = ti:TPL0401
U6 = ti:SN74LVC3G17DCTR: TRIPLE SCHMITT-TRIGGER BUFFER; MPN: SN74LVC3G17DCTR; OC_FARNELL: 1236391; OC_NEWARK: 90H3713; PACKAGE: SSOP-8; SUPPLIER: Texas Instruments
U8 = custom:M20DX256
U$1 U$4 U$5 = cc-by-sa:CC-BY-NC-SA
U$2 = encoder:EC20A
U$3 U$6 = exmachina:EXMACHINA-LOGO
U$10 = NXP:PCA9671D: Remote 16-bit I/O expander for Fm+ I2C-bus with reset
X6 = con-neutrik_ag:NC5?-SW: Neutrik Audio Connector XLR SERIES Stereo 1/4" jack Source: www.neutrik.com/; MPN: NC5MAV-SW; OC_FARNELL: unknown; OC_NEWARK: 31M5714

## Net classes
0 default: width 0.178 mm, drill 0.35 mm
1 power: width 0.406 mm, drill 0.013 mm

## Board
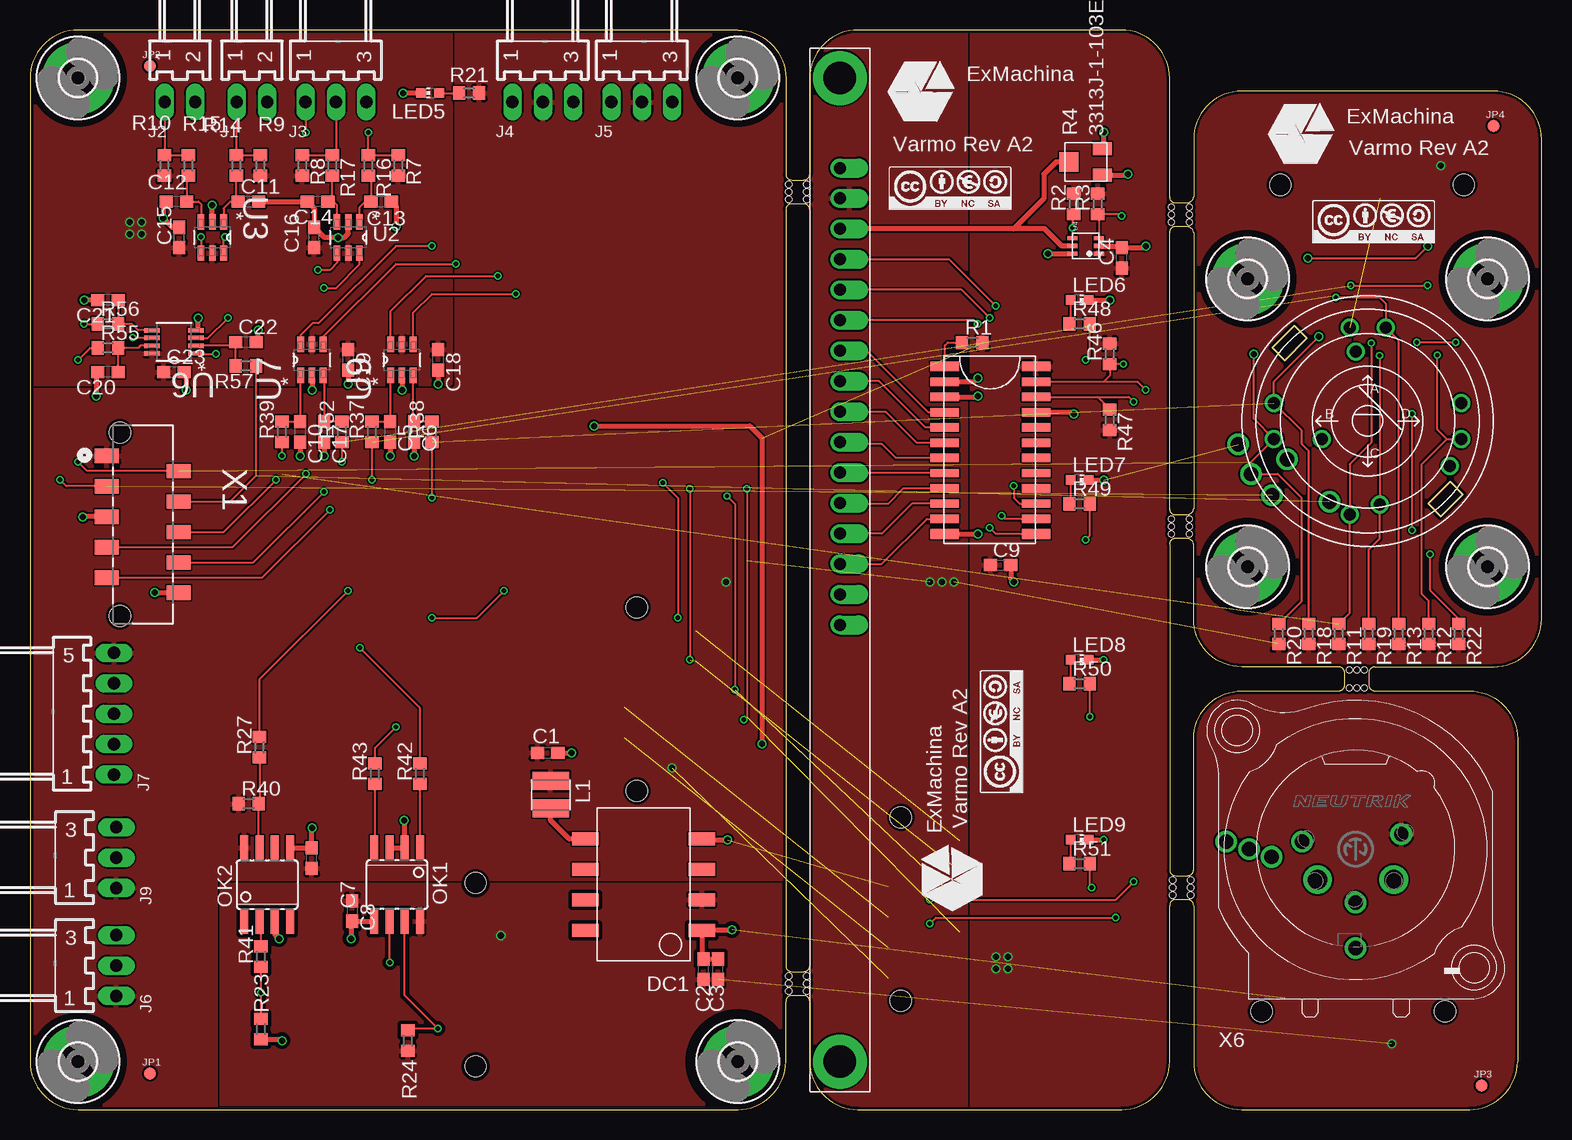
[diagram p3: board, top side]
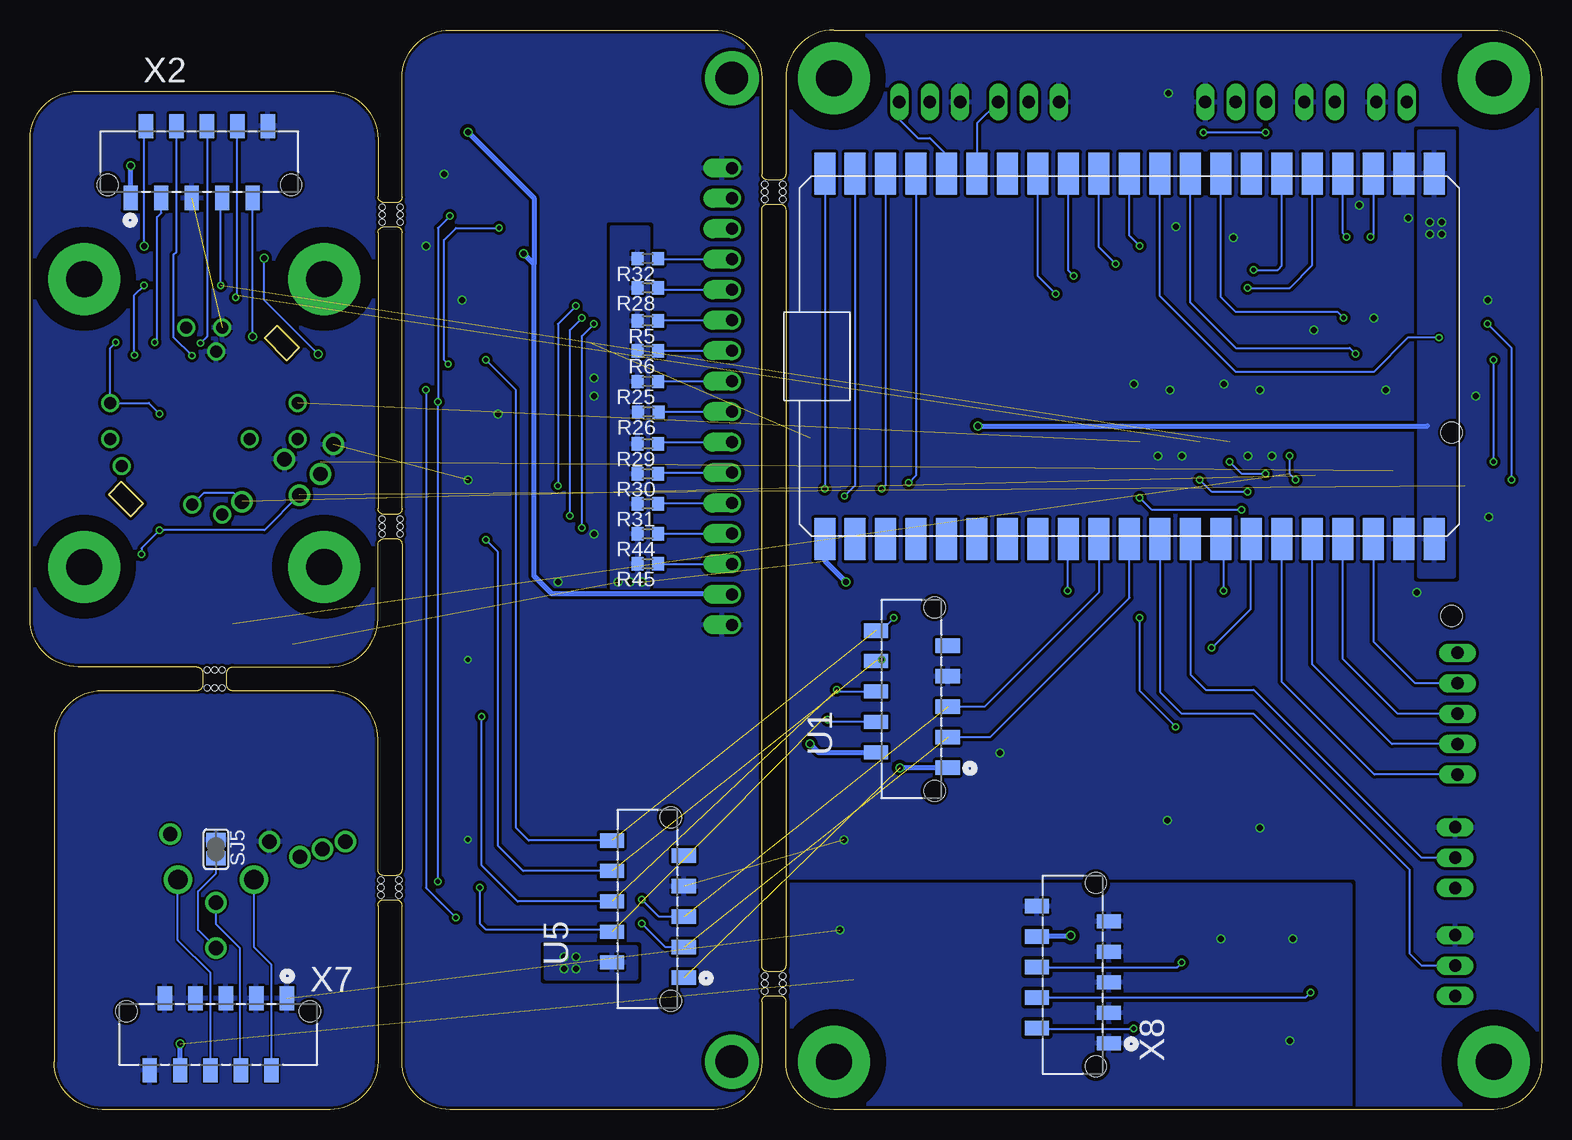
[diagram p4: board, bottom side, seen from below]

Size 126 x 90 mm. Coordinates in mm from the lower left corner, seen from the top.
Outline: 59,90 4,90 arc90 0,86 0,4 arc90 4,0 59,0 arc90 63,4 63,9 arc-90 63.5,9.5 64.5,9.5 arc-90 65,9 65,4 arc90 69,0 91,0 arc90 95,4 95,17 arc-90 95.5,17.5 96.5,17.5 arc-90 97,17 97,4 arc90 101,0 120,0 arc90 124,4 124,30.9 arc90 120,34.9 112.1,34.9 arc-90 111.6,35.4 111.6,36.4 arc-90 112.1,36.9 122,36.9 arc90 126,40.9 126,80.9 arc90 122,84.9 101,84.9 arc90 97,80.9 97,76.1 arc-90 96.4,75.6 95.4,75.6 arc-90 95,76.1 95,86 arc90 91,90 69,90 arc90 65,86 65,78 arc-90 64.5,77.5 63.5,77.5 arc-90 63,78 63,86 arc90 59,90
Outline: 63,12 arc90 63.5,11.5 64.5,11.5 arc90 65,12 65,75 arc90 64.5,75.5 63.5,75.5 arc90 63,75 63,12
Outline: 95,20 arc90 95.5,19.5 96.5,19.5 arc90 97,20 97,30.9 arc-90 101,34.9 109.1,34.9 arc90 109.6,35.4 109.6,36.4 arc90 109.1,36.9 101,36.9 arc-90 97,40.9 97,47.1 arc90 96.4,47.6 95.4,47.6 arc90 95,47.1 95,20
Outline: 97,73.1 arc90 96.4,73.6 95.4,73.6 arc90 95,73.1 95,50.1 arc90 95.4,49.6 96.4,49.6 arc90 97,50.1 97,73.1
Copper layers (1*16): Top 0.018mm / dielectric 1.55mm / Bottom 0.018mm
Design rules "eC_2Layer_PClass6_BaseCopperO18_eCDefault *": minimum track width 7mil, minimum drill 0.35mm, track to track 0.15mm, track to pad 0.15mm, pad to pad 0.15mm, via to via 0.15mm, smd to smd 0mil, copper to edge 0.25mm, drill to drill 0.35mm, minimum pad ring 0.175mm, minimum via ring 0.125mm, stop-mask expansion 0mil, vias tented up to drill 0.45mm, thermal gap 0.2mm
Holes 0.5 mm at 64.75,9.88 64.75,11.12 64.75,10.5 63.25,9.88 63.25,10.5 63.25,11.12 64.75,75.88 64.75,77.12 64.75,76.5 63.25,75.88 63.25,76.5 63.25,77.12 96.75,17.88 96.75,19.12 96.75,18.5 95.25,17.88 95.25,18.5 95.25,19.12 96.65,73.97 96.65,75.22 96.65,74.6 95.15,73.97 95.15,74.6 95.15,75.22 111.22,36.65 109.97,36.65 110.6,36.65 111.22,35.15 110.6,35.15 109.97,35.15 96.65,47.98 96.65,49.23 96.65,48.6 95.15,47.98 95.15,48.6 95.15,49.23

### Footprints (pad centres in the part's own frame; a part is rotated, then mirrored left to right if it is on the bottom)
C0603 = smd 1.1 x 1: 1 -0.85,0; 2 0.85,0
NTE = smd 1.067 x 2.184: 1 -3.81,-4.85; 3 -1.27,-4.85; 5 1.27,-4.85; 7 3.81,-4.85; 8 3.81,4.85; 10 1.27,4.85; 12 -1.27,4.85; 14 -3.81,4.85
RKJXT1F = drill 1: A -1.5,-7.8; B 7.8,-1.5; C 1.5,7.8; COM -1,5.78; D -7.8,1.5; ENCODERA -7.8,-1.5; ENCODERB 7.8,1.5; ENCODERCOM -1.5,7.8; GND 6.86,-3.75; LUG -3.8,-1.5; PUSH 1,-6.98
7395-02 = drill 1.016 long: 1 1.27,0; 2 -1.27,0
7395-03 = drill 1.016 long: 1 2.54,0; 2 0,0; 3 -2.54,0
7395-05 = drill 1.016 long: 1 5.08,0; 2 2.54,0; 3 0,0; 4 -2.54,0; 5 -5.08,0
FIDUCIAL-1X2 = smd 1 x 1: 1 0,0
8200 = smd 3.05 x 1.52: 1 0,1.145; 2 0,-1.145
CONNECTOR = drill 1 pad 1.6 offset: 1 -33.5,0; 2 -30.96,0; 3 -28.42,0; 4 -25.88,0; 5 -23.34,0; 6 -20.8,0; 7 -18.26,0; 8 -15.72,0; 9 -13.18,0; 10 -10.64,0; 11 -8.1,0; 12 -5.56,0; 13 -3.02,0; 14 -0.48,0; 15 2.06,0; 16 4.6,0 | drill 2.7 pad 4.5: 33 -41,0; 36 41,0
CHIP-LED0603 = smd 0.8 x 0.8: A 0,-0.75; C 0,0.75
P3,0 = drill 3 pad 6: 1 0,0
SOIC08 = smd 0.66 x 2.032: 1 -1.905,-3.073; 2 -0.635,-3.073; 3 0.635,-3.073; 4 1.905,-3.073; 5 1.905,3.073; 6 0.635,3.073; 7 -0.635,3.073; 8 -1.905,3.073
R0603 = smd 1 x 1.1: 1 -0.85,0; 2 0.85,0
3313J = smd 1.1 x 1.6: 1 1.1,-1.4; 3 -1.1,-1.4 | smd 1.6 x 1.6: 2 0,1.4
SJ = smd 1.168 x 1.6: 1 -0.762,0; 2 0.762,0
MOLEX_90814-0210 = smd 1.194 x 2.007: 1 0,0; 2 1.27,5.994; 3 2.54,0; 4 3.81,5.994; 5 5.08,0; 6 6.35,5.994; 7 7.62,0; 8 8.89,5.994; 9 10.16,0; 10 11.43,5.994 | hole 1.753: -1.93,1.092; 13.36,1.092
SOT95P280X145-6N = smd 1.27 x 0.559: 1 -1.295,0.94; 2 -1.295,0; 3 -1.295,-0.94; 4 1.295,-0.94; 5 1.295,0; 6 1.295,0.94
SC-70-DCK = smd 0.35 x 0.85: 1 -0.65,-1.1; 2 0,-1.1; 3 0.65,-1.1; 4 0.65,1.1; 5 0,1.1; 6 -0.65,1.1
SOP65P400X130-8N = smd 1.321 x 0.356: 1 -1.829,0.965; 2 -1.829,0.33; 3 -1.829,-0.33; 4 -1.829,-0.965; 5 1.829,-0.965; 6 1.829,-0.33; 7 1.829,0.33; 8 1.829,0.965
MK_CUSTOM = smd 1.75 x 3.5: 1 -25.4,15.24; 2 -22.86,15.24; 3 -20.32,15.24; 4 -17.78,15.24; 5 -15.24,15.24; 6 -12.7,15.24; 7 -10.16,15.24; 8 -7.62,15.24; 9 -5.08,15.24; 10 -2.54,15.24; 11 0,15.24; 12 2.54,15.24; 13 5.08,15.24; 14 7.62,15.24; 15 10.16,15.24; 16 12.7,15.24; 17 15.24,15.24; 18 17.78,15.24; 19 20.32,15.24; 20 22.86,15.24; 21 25.4,15.24; 22 25.4,-15.24; 23 22.86,-15.24; 24 20.32,-15.24; 25 17.78,-15.24; 26 15.24,-15.24; 27 12.7,-15.24; 28 10.16,-15.24; 29 7.62,-15.24; 30 5.08,-15.24; 31 2.54,-15.24; 32 0,-15.24; 33 -2.54,-15.24; 34 -5.08,-15.24; 35 -7.62,-15.24; 36 -10.16,-15.24; 37 -12.7,-15.24; 38 -15.24,-15.24; 39 -17.78,-15.24; 40 -20.32,-15.24; 41 -22.86,-15.24; 42 -25.4,-15.24
EC20A = drill 1.2: A -6.25,-9; B -1.25,-10; C -3.75,-10; D -2.5,-7; E 2.5,-7
SOT137-1 = smd 0.8 x 2.4: 1 -6.95,-3.75; 12 7.02,-3.75; 13 7.02,3.87; 24 -6.95,3.87 | smd 0.7 x 2.4: 2 -5.68,-3.75; 3 -4.41,-3.75; 4 -3.14,-3.75; 5 -1.87,-3.75; 6 -0.6,-3.75; 7 0.67,-3.75; 8 1.94,-3.75; 9 3.21,-3.75; 10 4.48,-3.75; 11 5.75,-3.75; 14 5.75,3.87; 15 4.48,3.87; 16 3.21,3.87; 17 1.94,3.87; 18 0.67,3.87; 19 -0.6,3.87; 20 -1.87,3.87; 21 -3.14,3.87; 22 -4.41,3.87; 23 -5.68,3.87
NC5MAV-SW = drill 1.2: 1 -4.445,0.635; 3 0,-4.445; 5 3.81,1.27; G 0,-8.225; N -8.89,0; NC -6.985,-0.635; NO -10.795,0.635 | drill 1.6: 2 -3.175,-2.54; 4 3.175,-2.54

### Placement (x,y rotation side)
C1  43.15,29.75 0 top
C2  56.15,11.7 90 top
C3  57.35,11.7 90 top
C4  91,71 90 top
C5  30,56.5 270 top
C6  32,56.5 270 top
C7  23.48,20.96 90 top
C8  26.85,16.56 270 top
C9  80.9,45.4 0 top
C10  22.5,56.5 270 top
C11  18.2,75.7 0 top
C12  12.2,75.7 180 top
C13  29.27,75.7 0 top
C14  23.98,75.7 180 top
C15  12.45,72.7 90 top
C16  23.7,72.7 90 top
C17  24.5,56.5 270 top
C18  34,62.5 270 top
C19  26.5,62.5 270 top
C20  6.5,61.5 180 top
C21  6.5,67.5 180 top
C22  18,64 0 top
C23  12,61.5 0 top
DC1  51.15,18.75 90 top
ENC1  111.5,57.4 0 top
J1  18.5,84 180 top
J2  12.5,84 180 top
J3  25.5,84 180 top
J4  42.75,84 180 top
J5  51,84 180 top
J6  7.2,12 270 top
J7  7,33 270 top
J9  7.2,21 270 top
JP1  10,3 0 top
JP2  10,87 0 top
JP3  121,2 0 top
JP4  122,82 0 top
L1  43.4,26.25 180 top
LCD1  67.5,45 270 top
LED5  33.35,84.75 90 top
LED6  87.5,67.5 270 top
LED7  87.5,52.5 270 top
LED8  87.5,37.5 270 top
LED9  87.5,22.5 270 top
MP1  4,4 0 top
MP2  4,86 0 top
MP3  59,4 0 top
MP4  59,86 0 top
MP5  121.5,45.25 0 top
MP6  101.5,69.25 0 top
MP7  101.5,45.25 0 top
MP8  121.5,69.25 0 top
OK1  30.6,18.75 180 top
OK2  19.77,18.75 0 top
R1  78.55,63.95 0 top
R2  87,75.5 90 top
R3  89,75.5 90 top
R4  88,79 90 top
R5  74.5,65.75 180 bottom
R6  74.5,63.25 180 bottom
R7  30.7,78.7 270 top
R8  22.7,78.7 270 top
R9  19.2,78.7 270 top
R10  11.2,78.7 270 top
R11  109.1,39.65 270 top
R12  116.6,39.65 270 top
R13  114.1,39.65 270 top
R14  17.2,78.7 270 top
R15  13.2,78.7 270 top
R16  28.2,78.7 270 top
R17  25.2,78.7 270 top
R18  106.6,39.65 270 top
R19  111.6,39.65 270 top
R20  104.1,39.65 270 top
R21  36.6,84.75 0 top
R22  119.1,39.65 270 top
R23  19.25,6.71 270 top
R24  31.5,5.75 90 top
R25  74.5,60.7 180 bottom
R26  74.45,58.15 180 bottom
R27  19.13,30.2 90 top
R28  74.5,68.5 180 bottom
R29  74.5,55.5 180 bottom
R30  74.5,53 180 bottom
R31  74.5,50.5 180 bottom
R32  74.5,70.95 180 bottom
R37  28.5,56.5 90 top
R38  33.5,56.5 90 top
R39  21,56.5 90 top
R40  18.23,25.5 0 top
R41  19.25,12.75 90 top
R42  32.5,28 90 top
R43  28.75,28 90 top
R44  74.5,48 180 bottom
R45  74.5,45.5 180 bottom
R46  90,63 90 top
R47  90,57.5 270 top
R48  87.5,65.5 0 top
R49  87.5,50.5 0 top
R50  87.5,35.5 0 top
R51  87.5,20.5 0 top
R52  26,56.5 90 top
R55  6.5,63.5 0 top
R56  6.5,65.5 0 top
R57  18,62 180 top
SJ5  110.5,21.7 270 bottom
U1  49.5,28.5 90 bottom
U2  26.53,72.7 270 top
U3  15.2,72.7 270 top
U4  88,72 90 top
U5  71.5,11 90 bottom
U6  12,64 180 top
U7  23.5,62.5 90 top
U8  34.35,62.8 0 bottom
U9  31,62.5 90 top
U$1  76.7,76.8 0 top
U$2  111.5,57.4 315 top
U$3  105.9,81.3 0 top
U$4  112,74 0 top
U$5  81,31.5 90 top
U$6  74.22,84.83 0 top
U$9  EXMACHINA-LOGO-NAME  [EXM-LOGO-BASELINE]  76.9,19.2 90 top
U$10  80,55 270 top
X1  6.4,54.5 270 top
X2  117.6,76 0 bottom
X6  110.5,21.7 0 top
X7  104.59,9.28 180 bottom
X8  36.05,5.53 90 bottom

### Tracks (layer width: path | path; a pad name or v marks a point on that pad's centre or on a via)
+3V3  (via drill 0.5)  (1 unrouted)
  Top 0.406: v47,57 60,57 61,56 v61,30.5
  Bottom 0.406: v47,57 9.5,57 | v61,30.5 60.27,29.77 U1.2
  other vias: 9.3,74 8.3,74 8.3,73 9.3,73 80.5,12.75 81.5,12.75 80.5,11.75 81.5,11.75
  pour Top: 0,60.5 0,86 arc-90 4,90 35,90 35,60.5
  pour Bottom: 7.3,81.5 10.2,81.5 10.2,44.5 7.3,44.5
  pour Top: 78.5,91 78.5,-3 95,-0.5 95,91
  pour Bottom: 75.5,13.5 83,13.5 83,11 75.5,11
+5V  (via drill 0.5, 0.55)  (1 unrouted)
  Bottom 0.406: X8.8 42.13,14.5 v39.25,14.5 | X7.8 113.48,5.49 v113.5,5.5
  pour Top: 96,36 96,0 121,0 arc90 125,4 127,35.5
  pour Top (isolate 0.305): 16,18.75 64,18.75 64,0 16,0
+5V/1  (via drill 0.5)  (3 unrouted)
  Bottom 0.406: U8.42 59.75,45.75 v58,44 | U1.1 v53.5,28.5 | X2.1 v117.6,78.7
  other vias: 75,44 76,44 77,44
  pour Top (rank 4): 132,-7 131,97 -7,97 -7,-7
  pour Top (isolate 0.254, rank 3): 95.5,-3 95.5,98 64,98 64,-3
  pour Bottom: 74.5,73.5 77.5,73.5 77.5,43.5 74.5,43.5
D0
  Top 0.178: LCD1.7 69.74,63.26 74.86,58.14 U$10.4
  Bottom 0.178: R6.1 LCD1.7
D1
  Top 0.178: U$10.5 74.63,56.87 70.78,60.72 LCD1.8
  Bottom 0.178: R25.1 73.63,60.72 LCD1.8
D2
  Top 0.178: LCD1.9 71.32,58.18 73.9,55.6 U$10.6
  Bottom 0.178: R26.1 73.57,58.18 LCD1.9
D3
  Top 0.178: U$10.7 72.17,54.33 71,55.5 67.64,55.5 LCD1.10
  Bottom 0.178: R29.1 73.51,55.64 LCD1.10
D4
  Top 0.178: U$10.8 67.54,53.06 LCD1.11
  Bottom 0.178: R30.1 73.55,53.1 LCD1.11
D5
  Top 0.178: U$10.9 72.79,51.79 71.5,50.5 67.56,50.5 LCD1.12
  Bottom 0.178: R31.1 73.59,50.56 LCD1.12
D6
  Top 0.178: U$10.10 73.52,50.52 71.02,48.02 LCD1.13
  Bottom 0.178: R44.1 73.63,48.02 LCD1.13
D7
  Top 0.178: LCD1.14 70.98,45.48 74.75,49.25 U$10.11
  Bottom 0.178: R45.1 73.63,45.48 LCD1.14
DIR_A  (via drill 0.35)  (1 unrouted)
  Top 0.178: v111.8,63.9 111.8,55.6 110,53.8 ENC1.A 110,41.4 R11.1 | X1.6 16.15,48.15 v20.5,52.5 | v21,54.5 R39.1
  Bottom 0.178: v111.8,63.9 111.25,64.45 X2.6 | v20.5,52.5 21,53 v21,54.5
DIR_A_MCU  (via drill 0.35)
  Top 0.178: v33.5,72 30.5,72 24.06,65.56 23.56,65.56 22.56,64.56 U7.6
  Bottom 0.178: v33.5,72 34.35,72.85 U8.11
DIR_B  (via drill 0.35)  (1 unrouted)
  Top 0.178: 118.1,55.9 116,53.8 116,43 116.6,42.4 R12.1 | 118.1,55.9 ENC1.B | v117.3,62.9 117.3,56.7 118.1,55.9 | v110.1,68.7 v116.5,68.7 | X1.7 16.88,46.88 v23,53 | v26,54 R52.1
  Bottom 0.178: v110.1,68.7 110.1,75.88 X2.7 | v117.3,62.9 117.3,67.9 v116.5,68.7 | v23,53 25,53 v26,54
DIR_B_MCU  (via drill 0.35)
  Top 0.178: v35.5,70.5 30.5,70.5 24.44,64.44 U7.4
  Bottom 0.178: v35.5,70.5 36.89,71.89 U8.10
DIR_C  (via drill 0.35)  (1 unrouted)
  Top 0.178: v108.85,67.7 112.5,67.7 113,67.2 ENC1.C 114.1,64.1 R13.1 | X1.8 18.61,45.61 v24.5,51.5 | v28.5,52.5 R37.1
  Bottom 0.178: v108.85,67.7 108.71,67.84 X2.8 | v24.5,51.5 27.5,51.5 v28.5,52.5
DIR_C_MCU  (via drill 0.35)
  Top 0.178: U9.6 30.06,66.56 33,69.5 v39,69.5
  Bottom 0.178: v39,69.5 39.43,69.93 U8.9
DIR_D  (via drill 0.35, 0.5)  (1 unrouted)
  Top 0.178: v107.44,64.44 103.7,60.7 ENC1.D 106,56.6 106,55.5 106.6,54.9 R18.1 | X1.9 19.34,44.34 v25,50 | v33.5,51 R38.1
  Bottom 0.178: v107.44,64.44 X2.9 | v25,50 32.5,50 v33.5,51
DIR_D_MCU  (via drill 0.35)
  Top 0.178: U9.4 31.94,66.44 33.5,68 v40.5,68
  Bottom 0.178: v40.5,68 41.97,69.47 U8.8
DIRECTION_1  (via drill 0.35)
  Top 0.178: v24.5,68.5 25.5,68.5 27.47,70.47 U2.6
  Bottom 0.178: v24.5,68.5 21,68.5 19.11,70.39 U8.17
DIRECTION_2  (via drill 0.35)
  Top 0.178: U2.4 25.59,70.59 25,70 v24,70
  Bottom 0.178: v24,70 22,70 21.65,70.35 U8.16
E  (via drill 0.35)
  Top 0.178: U$10.13 80.52,47.98 v80,48.5 | v79,65.5 78.7,65.8 LCD1.6
  Bottom 0.178: v80,48.5 80,64.5 v79,65.5 | R5.1 73.6,65.8 LCD1.6
ENCODER_A  (via drill 0.35, 0.5)  (1 unrouted)
  Top 0.178: R20.1 106,42.4 106,51 104.02,52.98 U$2.C 101.78,53.98 ENC1.ENCODERA 102,57.6 v102,63 | X1.2 4.77,53.23 v4,54 | v4,62.5 5,63.5 R55.1 | v106.5,71 115.5,71 v116.5,72
  Bottom 0.178: v4,54 v4,62.5 | v102,63 106.5,67.5 v106.5,71 | v116.5,72 116.5,81.82 X2.2
ENCODER_A_MCU  (via drill 0.35)
  Top 0.178: U6.1 13.86,63 v15.5,63
  Bottom 0.178: U8.13 29.27,67.27 25.5,63.5 16,63.5 v15.5,63
ENCODER_B  (via drill 0.35)  (1 unrouted)
  Top 0.178: v118.85,63.95 v115.6,63.95 | v115.2,58 v115.2,48.3 | v116.7,46.3 116.7,43.3 119.1,40.9 R22.1 | X1.3 3.04,51.96 v2.5,52.5 | v4.5,65.5 R56.1
  Bottom 0.178: 115.1,75.96 X2.3 115.06,74.74 115.4,74.4 115.4,64.15 v115.6,63.95 | v115.2,58 116.1,58.9 ENC1.ENCODERB 119.3,63.5 v118.85,63.95 | U$2.B 106.46,48.3 v115.2,48.3 116.7,46.8 v116.7,46.3 | v2.5,52.5 2.5,63.5 v4.5,65.5
ENCODER_B_MCU  (via drill 0.35)
  Top 0.178: U6.3 14.83,64.33 v16.5,66
  Bottom 0.178: v16.5,66 17,66.5 25.5,66.5 26.73,67.73 U8.14
ESW3_RX  (via drill 0.35)
  Top 0.178: OK1.7 31.23,9.52 v34,6.75 31.65,6.75 R24.2
  Bottom 0.178: X8.2 42,6.75 v34,6.75
ESW3_RX_ISO  (via drill 0.35)
  Top 0.178: R42.2 32.5,33.5 v27.5,38.5
  Bottom 0.178: v27.5,38.5 24.25,41.75 24.25,47.5 U8.28
ESW3_TOR  (via drill 0.35)
  Top 0.178: v30,12.25 29.96,12.29 OK1.6
  Bottom 0.178: X8.6 30.38,11.88 v30,12.25
ESW3_TOR_ISO  (via drill 0.35)
  Top 0.178: v33.5,41 37.25,41 v39.5,43.25 | R43.2 28.75,30.15 v30.5,31.9
  Bottom 0.178: v39.5,43.25 39.5,47.49 U8.34 | v30.5,31.9 33.5,34.9 v33.5,41
ESW3_TX  (via drill 0.35)
  Top 0.178: R41.1 v19.25,9.75 R23.1
  Bottom 0.178: X8.4 19.66,9.34 v19.25,9.75
ESW3_TX_ISO  (via drill 0.35)
  Top 0.178: v26.5,43.25 19.13,35.88 R27.2
  Bottom 0.178: v26.5,43.25 26.5,47.33 U8.29
GND  (via drill 0.5)  (1 unrouted)
  Top 0.406: v26.75,14.25 26.75,15.6 C8.2 26.91,15.65 26.93,15.68 OK1.5 | OK2.3 20.41,14.59 v20.75,14.25 | R23.2 20.89,5.86 v21,5.75 | C3.2 C2.2 56,12.7 DC1.1 56.06,15 v58.5,15
  pour Bottom (rank 2): 96,0 121,0 arc90 125,4 127,35.5 96,36
  pour Bottom (isolate 0.305): 16,18.75 16,0 64,0 64,18.75
GND1  (via drill 0.35, 0.5)  (3 unrouted)
  Top 0.406: v58.15,22.5 56.06,22.5 DC1.7 | C1.2 v45.15,29.75 | LED5.C v31.1,84.75 | X1.10 10.43,43.07 v10.4,43.1 | X1.5 4.42,49.42 v4.4,49.4 | C11.2 C14.2 23.7,75.13 C16.2 24.55,72.7 v25.7,72.7 26.2,72.7 26.53,73.03 U2.2 26.53,73.53 | C13.2 30.5,75.32 v30.5,73.6 | C12.2 11.1,75.45 v11.1,74.3 11.85,73.55 C15.2 | U3.2 v15.2,75.4 | OK2.5 C7.2 23.48,23.48 v23.5,23.5 | v31.2,24.1 31.23,24.07 OK1.2 OK1.3 | U4.2 90.85,72 C4.2 92.85,71.85 v93,72 | LED6.C v90,67.5 | LED7.C v89.5,52.5 | LED8.C v89.5,37.5 | LED9.C v89.5,22.5 | R4.3 91.4,77.9 v91.5,78 | U$10.3 78.91,59.41 v79,59.5 | U$10.2 78.68,60.68 v79,61 | U$10.12 78.98,47.98 v79,48 | C9.2 81.75,44.25 v82,44 | U$10.21 86.86,58.14 v87,58 | C10.2 v22.5,54.5 | C17.2 v24.5,54.5 | C5.2 v30,54.5 | C6.2 v32,54.5 | U7.2 v23.5,60 | C19.2 v26.5,60.5 | U9.2 v31,60 | C18.2 v34,60.5 | C20.2 5.5,61.35 v5.5,59.5 | C21.2 v4.5,67.5 | C23.2 13,61.35 v13,60 | U6.4 14,65.14 v14,66 | C22.2 19,64.15 v19,65
  pour Bottom (isolate 0.254, rank 4): -5.5,90 -7,-7 132,-7 133.5,90
  pour Bottom (isolate 0.254, rank 3): 64,97.5 64,-3.5 95.5,-3 95.5,98
JOGWHEEL_1
  Bottom 0.178: J9.2 10,21 24,35 28,35 29.27,36.27 U8.30
JOGWHEEL_2
  Bottom 0.178: J6.2 10,12 11,13 11,20 24,33 30,33 31.81,34.81 U8.31
LED_1
  Bottom 0.178: 47.05,78.7 U8.6 47.05,82.24 J4.3
LED_2
  Bottom 0.178: J5.3 53.54,82.54 52,81 51,81 49.59,79.59 U8.5
LED_STATUS_1  (via drill 0.35)  (1 unrouted)
  Top 0.178: v52.75,52.25 54,51 v54,41 | v88,62.5 88.35,62.85 R48.2
  Bottom 0.178: U8.4 52.13,52.87 v52.75,52.25 | U5.10 84.43,22.43 85.5,23.5 85.5,60 v88,62.5 | U1.10 55.07,39.93 v54,41
LED_STATUS_2  (via drill 0.35)  (2 unrouted)
  Top 0.178: v55,51.75 v55,37.5 | v88,47.5 88.35,47.85 R49.2
  Bottom 0.178: U8.3 54.67,52.08 v55,51.75 | U5.8 84.89,19.89 87,22 87,46.5 v88,47.5
LED_STATUS_3  (via drill 0.35)  (1 unrouted)
  Top 0.178: v58.1,51.15 58.75,50.5 v58.75,35 | v88.35,32.75 R50.2
  Bottom 0.178: U8.2 57.21,52.04 v58.1,51.15 | v58.75,35 58.6,34.85 U1.6 | U5.6 85.35,17.35 88.35,20.35 v88.35,32.75
LED_STATUS_4  (via drill 0.35)  (1 unrouted)
  Top 0.178: v59.75,51.75 59.75,32.75 v59.5,32.5 | v88.5,18.5 88.35,18.65 R51.2
  Bottom 0.178: U8.1 v59.75,51.75 | 59.37,32.37 v59.5,32.5 59.31,32.31 U1.4 | U5.4 77.68,15 88,15 88.5,15.5 v88.5,18.5
N$1
  Top 0.406: DC1.8 44.94,22.56 43.4,24.1 L1.1
N$2
  Top 0.178: U$10.1 76.25,63.7 76.5,63.95 R1.1
N$4
  Top 0.178: R48.1 86.75,65.6 LED6.A
N$6
  Top 0.178: R15.1 R10.1 11.23,79.58 J2.1
N$7
  Top 0.178: R9.1 R14.1 17.2,83.97 J1.1
N$8  (via drill 0.35)
  Top 0.178: R7.1 R16.1 v28.2,81.45 | J3.1 22.96,81.49 v23,81.45
  Bottom 0.178: v23,81.45 v28.2,81.45
N$9
  Top 0.178: R8.1 R17.1 25.5,79.85 J3.2
N$10
  Top 0.178: R16.2 28.42,77.63 C13.1 27.95,75.7 27.47,75.22 U2.1
N$11
  Top 0.178: R17.2 25.2,76.07 C14.1 25.3,75.7 25.59,75.41 U2.3
N$12
  Top 0.178: R15.2 13.05,77.7 C12.1 14.05,75.7 14.25,75.5 U3.3 14.26,74.14
N$13
  Top 0.178: U3.1 16.14,75.14 16.7,75.7 C11.1 17.2,75.85 R14.2
N$15
  Top 0.178: R27.1 19.13,25.55 R40.2 19.08,21.82 OK2.7
N$17
  Top 0.178: C10.1 22.56,57.35 | R39.2 C10.1 | C10.1 22.56,57.41 U7.1
N$22
  Top 0.178: R49.1 86.75,50.6 LED7.A
N$23
  Bottom 0.178: X6.G 112,14.97 112,18.2 110.5,19.7 SJ5.2
N$24
  Top 0.178: R50.1 86.75,35.6 LED8.A
N$29
  Top 0.178: R51.1 86.75,20.6 LED9.A
N$30
  Top 0.178: R52.2 C17.1 24.5,61.14 U7.3
N$31
  Top 0.178: R37.2 C5.1 30.06,57.41 U9.1
N$32
  Top 0.178: R38.2 C6.1 31.94,57.41 U9.3
N$35
  Top 0.178: LED5.A R21.1
N$37
  Top 0.178: OK1.1 R42.1
N$38
  Top 0.178: OK1.4 28.75,21.88 R43.1
N$39
  Top 0.178: R41.2 19.25,15.57 OK2.2
N$40
  Top 0.178: U6.7 9.17,63.67 9,63.5 R55.2 C20.1
N$41
  Top 0.178: C21.1 R56.2 8.5,65.5 9,65 10.14,65 U6.5
N$42
  Top 0.178: R57.2 C22.1 16.82,63.67 U6.2
PUSH  (via drill 0.35)  (1 unrouted)
  Top 0.178: v112.5,62.85 ENC1.PUSH 112.5,47.6 111.6,46.7 R19.1 | X1.4 16.69,50.69 18.85,52.85 R57.1
  Bottom 0.178: v112.5,62.85 114.05,64.4 114.05,71.23 113.79,71.49 X2.4 | U$2.E 109.04,51.4 111.52,51.4 ENC1.PUSH
PUSH_BUTTON_1  (via drill 0.35)
  Top 0.178: U3.6 16.14,72.64 v16.25,72.75
  Bottom 0.178: v16.25,72.75 16.57,73.07 U8.18
PUSH_BUTTON_2  (via drill 0.35)
  Top 0.178: v14.25,72.75 14.25,71.42 U3.4
  Bottom 0.178: U8.19 14.03,72.97 v14.25,72.75
PUSH_MCU  (via drill 0.35)
  Top 0.178: U6.6 8.57,64.33 v8.55,64.35
  Bottom 0.178: v8.55,64.35 11.15,64.35 14,61.5 25.5,61.5 31.81,67.81 U8.12
R/W  (via drill 0.35)
  Top 0.178: U$10.14 81.25,49.25 v81,49.5 | v80,66 77.66,68.34 LCD1.5
  Bottom 0.178: v81,49.5 81,65 v80,66 | R28.1 73.49,68.34 LCD1.5
RS  (via drill 0.35)
  Top 0.178: LCD1.4 76.62,70.88 v80.5,67 | v82,52 82,51 82.48,50.52 U$10.15
  Bottom 0.178: v80.5,67 82,65.5 v82,52 | R32.1 73.58,70.88 LCD1.4
RX
  Bottom 0.178: X7.2 105.86,12.06 107.33,13.53 X6.2
SCL  (via drill 0.35)  (1 unrouted)
  Top 0.178: U4.3 89.1,74.55 R3.1 90.85,74.65 v91,74.5 | U$10.22 89,59.41 | 89,59.41 91.59,59.41 v92,59 | R47.1 90,58.41 89,59.41 | v75,17.5 90.5,17.5 v92,19
  Bottom 0.178: U8.33 36.89,43.11 46.42,33.58 U1.5 | U5.5 73.58,16.08 v75,17.5 | v91,74.5 92,73.5 v92,59 v92,19
SDA  (via drill 0.35)  (1 unrouted)
  Top 0.178: U$10.23 89.5,60.68 | 89.5,60.68 92.32,60.68 v93,60 | R2.1 86.9,74.55 v86.9,73.5 U4.4 | 89.5,60.68 90,61.18 R46.1 v91.15,62.15 | v75,15.5 75.5,16 v90.5,16
  Bottom 0.178: U8.32 34.35,42.65 45.96,31.04 U1.3 | U5.3 73.04,13.54 v75,15.5 | v86.9,73.5 90.5,73.5 91.5,72.5 91.5,62.5 v91.15,62.15 | v93,60 93,18.5 v90.5,16
TOR
  Bottom 0.178: X7.6 110.94,11.39 113.67,14.12 X6.4
TX
  Bottom 0.178: X7.4 108.5,3.38 108.5,13.45 110.5,15.45 X6.3
VEE  (via drill 0.5)
  Top 0.406: v84.85,71.35 U4.6 | R4.1 89.5,80.2 v89.5,81.5
  Bottom 0.406: LCD1.15 67.56,43 82.5,43 84,44.5 84,70.5 | 84,70.5 v84.85,71.35 | v89.5,81.5 84,76 84,70.5
VO
  Top 0.406: 82,73.42 84.58,73.42 86,72 U4.5 | 82,73.42 LCD1.3 | R4.2 85.5,79 84.5,78 84.5,75.92 82,73.42
WHEEL_0_LED_1
  Bottom 0.178: J7.1 13.92,27.92 21.65,35.65 U8.27
WHEEL_0_LED_2
  Bottom 0.178: J7.2 12.46,30.46 19.11,37.11 U8.26
WHEEL_1_LED_1
  Bottom 0.178: J7.3 12,33 16.57,37.57 U8.25
WHEEL_1_LED_2
  Bottom 0.178: J7.4 10.54,35.54 14,39 14,47.53 U8.24

### Text on the board
tPlace: Varmo Rev A2 | Varmo Rev A2 | Varmo Rev A2